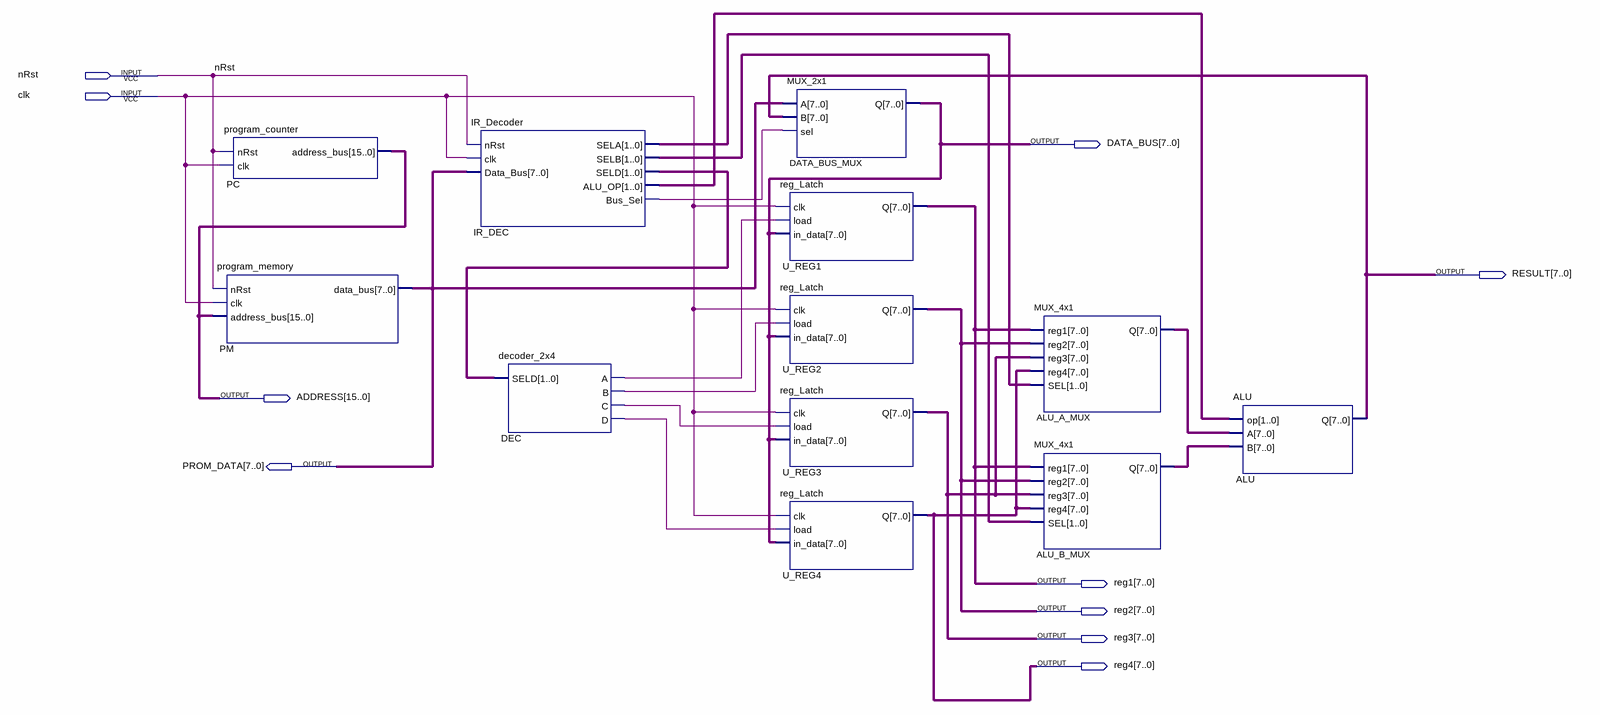
[diagram p0: schematic sheet]
// Quartus schematic top_bdf.bdf as structural Verilog: 12 symbols, 10 pins
module top_bdf (
  input  nRst,
  input  clk,
  output [7:0] DATA_BUS,
  output [7:0] RESULT,
  output [15:0] ADDRESS,
  output [7:0] PROM_DATA,
  output [7:0] reg1,
  output [7:0] reg2,
  output [7:0] reg3,
  output [7:0] reg4
);

  wire DEC_a, DEC_b, DEC_c, DEC_d, IR_DEC_bus_sel;
  wire [1:0] IR_DEC_alu_op, IR_DEC_sela, IR_DEC_selb, IR_DEC_seld;
  wire [7:0] ALU_A_MUX_q, ALU_B_MUX_q;

  program_counter PC (.nRst(nRst), .clk(clk), .address_bus(ADDRESS));
  program_memory PM (.nRst(nRst), .clk(clk), .address_bus(ADDRESS), .data_bus(PROM_DATA));
  IR_Decoder IR_DEC (
    .nRst(nRst), .clk(clk), .Data_Bus(PROM_DATA), .SELA(IR_DEC_sela), .SELB(IR_DEC_selb), .SELD(IR_DEC_seld),
    .ALU_OP(IR_DEC_alu_op), .Bus_Sel(IR_DEC_bus_sel));
  decoder_2x4 DEC (.SELD(IR_DEC_seld), .A(DEC_a), .B(DEC_b), .C(DEC_c), .D(DEC_d));
  MUX_2x1 DATA_BUS_MUX (.A(PROM_DATA), .B(RESULT), .sel(IR_DEC_bus_sel), .Q(DATA_BUS));
  reg_Latch U_REG1 (.clk(clk), .load(DEC_a), .in_data(DATA_BUS), .Q(reg1));
  reg_Latch U_REG2 (.clk(clk), .load(DEC_b), .in_data(DATA_BUS), .Q(reg2));
  reg_Latch U_REG3 (.clk(clk), .load(DEC_c), .in_data(DATA_BUS), .Q(reg3));
  reg_Latch U_REG4 (.clk(clk), .load(DEC_d), .in_data(DATA_BUS), .Q(reg4));
  MUX_4x1 ALU_A_MUX (.reg1(reg1), .reg2(reg2), .reg3(reg3), .reg4(reg4), .SEL(IR_DEC_sela), .Q(ALU_A_MUX_q));
  MUX_4x1 ALU_B_MUX (.reg1(reg1), .reg2(reg2), .reg3(reg3), .reg4(reg4), .SEL(IR_DEC_selb), .Q(ALU_B_MUX_q));
  ALU ALU (.op(IR_DEC_alu_op), .A(ALU_A_MUX_q), .B(ALU_B_MUX_q), .Q(RESULT));
endmodule
